# EAGLE schematic ESCD (EAGLE 9.6.2)
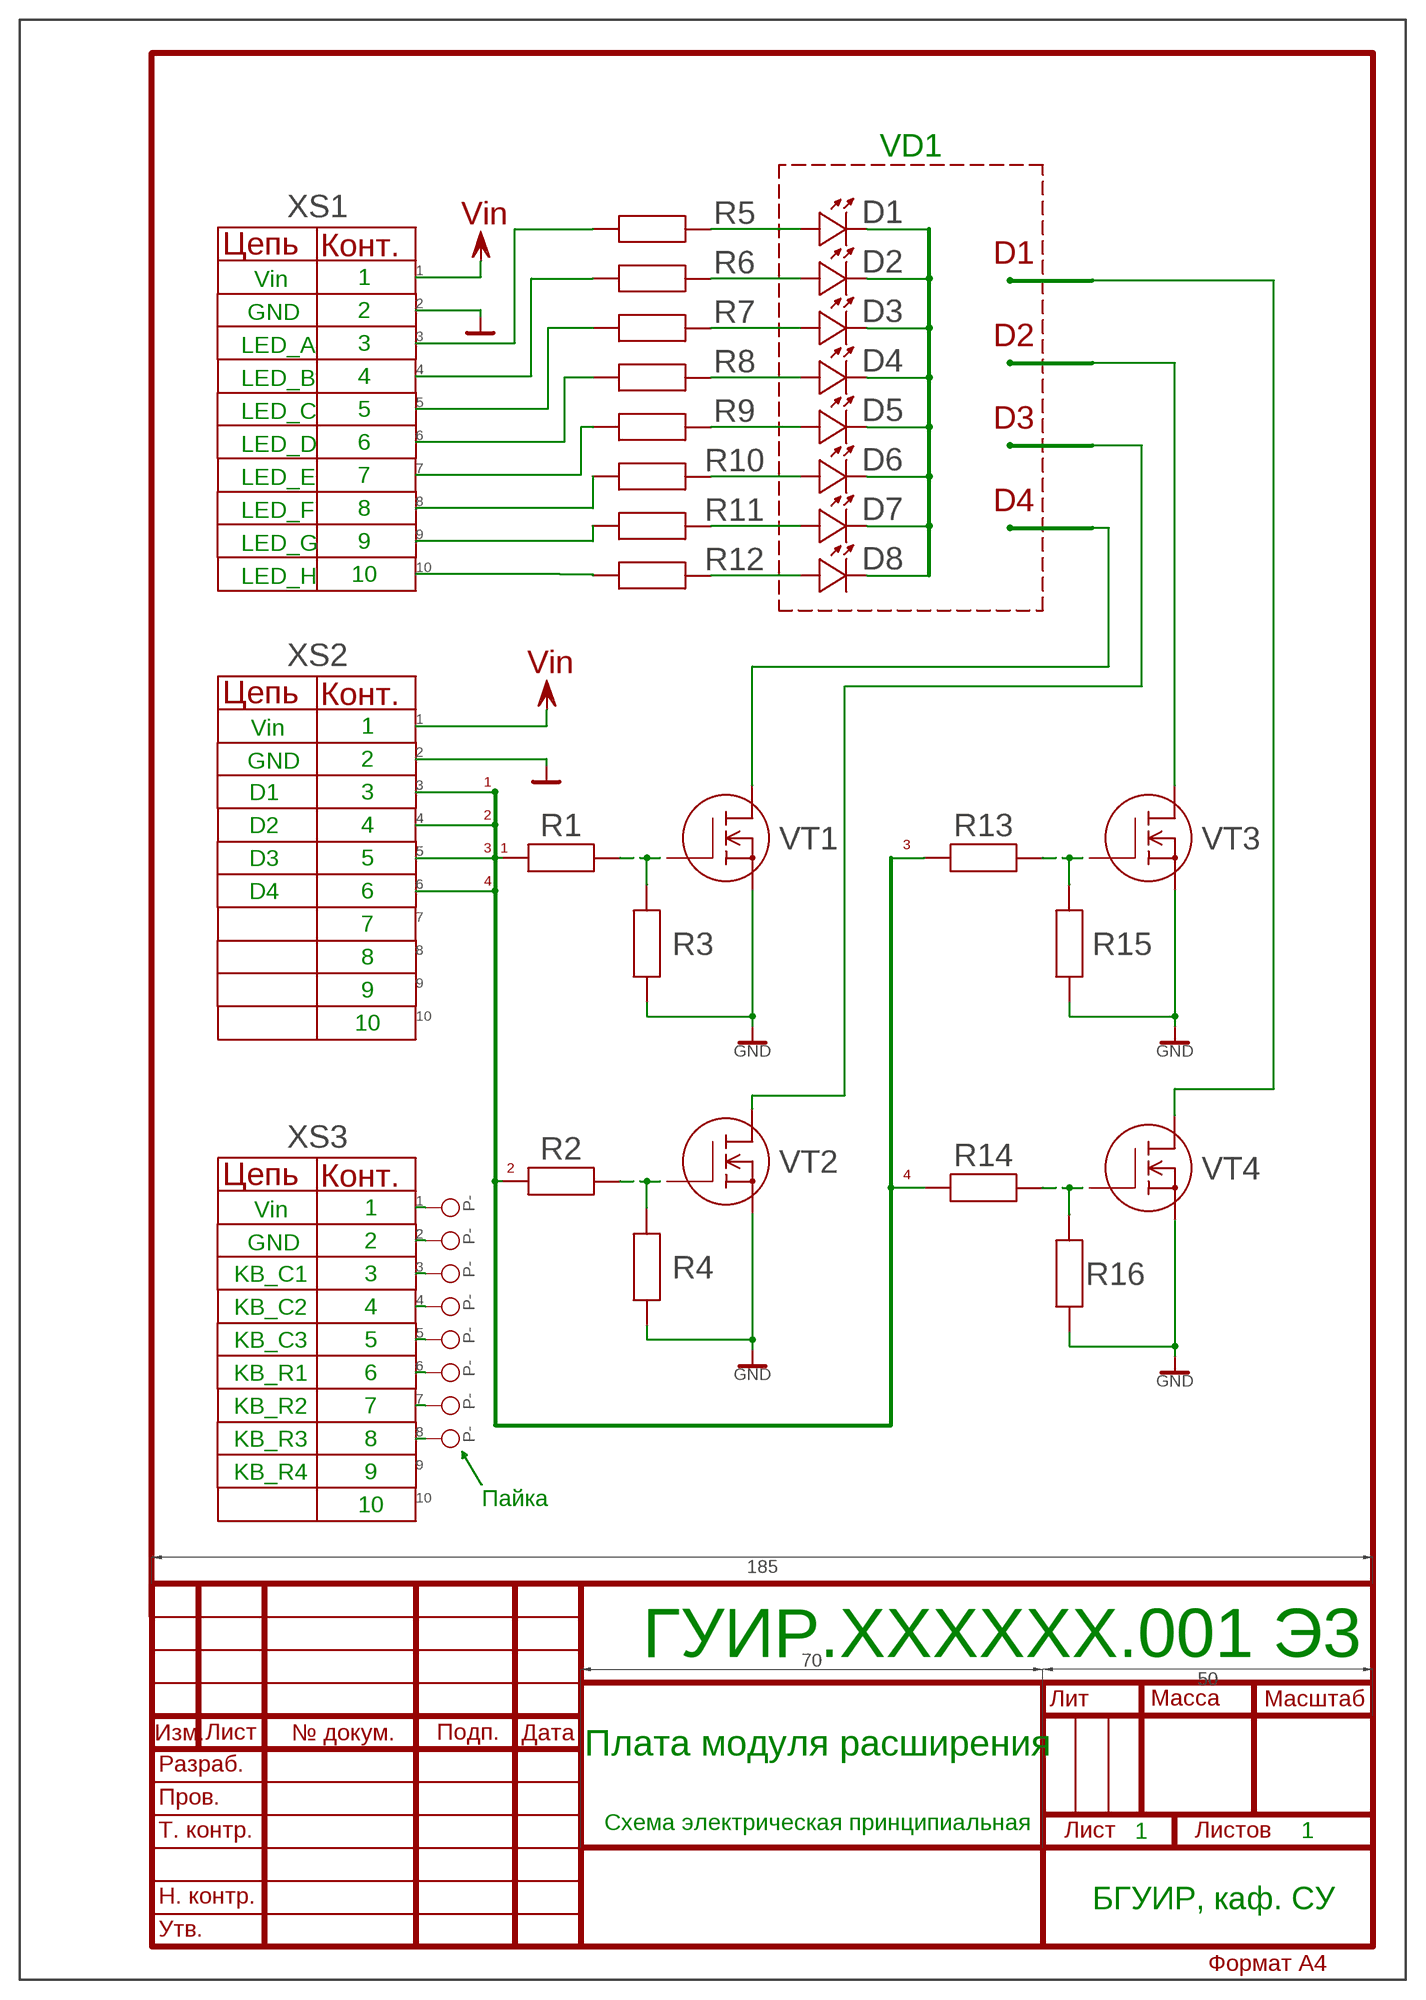
[diagram p0: schematic, sheet 1]

## Parts
D1  ESCD_LED  [SOD106A]
D2  ESCD_LED  [SOD106A]
D3  ESCD_LED  [SOD106A]
D4  ESCD_LED  [SOD106A]
D5  ESCD_LED  [SOD106A]
D6  ESCD_LED  [SOD106A]
D7  ESCD_LED  [SOD106A]
D8  ESCD_LED  [SOD106A]
R1  ESCD_RES  [R1206]
R2  ESCD_RES  [R1206]
R3  ESCD_RES  [R1206]
R4  ESCD_RES  [R1206]
R5  ESCD_RES  [R1206]
R6  ESCD_RES  [R1206]
R7  ESCD_RES  [R1206]
R8  ESCD_RES  [R1206]
R9  ESCD_RES  [R1206]
R10  ESCD_RES  [R1206]
R11  ESCD_RES  [R1206]
R12  ESCD_RES  [R1206]
R13  ESCD_RES  [R1206]
R14  ESCD_RES  [R1206]
R15  ESCD_RES  [R1206]
R16  ESCD_RES  [R1206]
VT1  MOSFET_GOST  [MOSFET]
VT2  MOSFET_GOST  [MOSFET]
VT3  MOSFET_GOST  [MOSFET]
VT4  MOSFET_GOST  [MOSFET]
XS1  ESCD_CONNECTOR_10POS  [S10B-PH-SM4-TB]
XS2  ESCD_CONNECTOR_10POS  [S10B-PH-SM4-TB]
XS3  ESCD_CONNECTOR_10POS  [S10B-PH-SM4-TB]

## Nets
GND: R3.1 R4.1 R15.1 R16.1 VT1.P$1 VT2.P$1 VT3.P$1 VT4.P$1 XS1.2 XS2.2
N$1: R5.2 XS1.3
N$2: R6.2 XS1.4
N$3: R7.2 XS1.5
N$4: R8.2 XS1.6
N$5: R9.2 XS1.7
N$6: R10.2 XS1.8
N$7: R11.2 XS1.9
N$8: XS1.10
N$9: VT4.P$2
N$11: VT2.P$2
N$12: VT1.P$2
N$13: R1.2 R3.2 VT1.P$3
N$14: R1.1 R2.1 R13.1 R14.1 XS2.3 XS2.4 XS2.5 XS2.6
N$15: R13.2 R15.2 VT3.P$3
N$16: R2.2 R4.2 VT2.P$3
N$17: R14.2 R16.2 VT4.P$3
N$20: VT3.P$2
N$21: R12.2
N$76: D1.A R5.1
N$77: D2.A R6.1
N$78: D3.A R7.1
N$79: D4.A R8.1
N$80: D5.A R9.1
N$81: D6.A R10.1
N$82: D7.A R11.1
N$83: D8.A R12.1
VCC: XS1.1 XS2.1 XS3.1 XS3.2 XS3.3 XS3.4 XS3.5 XS3.6 XS3.7 XS3.8 ; supply symbol labelled P-
Unconnected: D1.K D2.K D3.K D4.K D5.K D6.K D7.K D8.K XS2.7 XS2.8 XS2.9 XS2.10 XS3.9 XS3.10

## Notes on the sheet
- VD1
- Vin
- D1
- Vin | 1
- GND | 2
- LED_A | 3 | D2
- LED_B | 4
- LED_C | 5
- D3
- LED_D | 6
- LED_E | 7
- LED_F | 8 | D4
- LED_G | 9
- LED_H | 10
- Vin
- Vin | 1
- GND | 2
- 1
- D1
- 3
- 2
- D2
- 4
- 3 | 1 | 3
- D3
- 5
- 4
- D4
- 6
- 7
- 8
- 9
- 10
- 2
- 4
- Vin | 1
- GND | 2
- KB_C1
- 3
- KB_C2
- 4
- KB_C3
- 5
- KB_R1
- 6
- KB_R2
- 7
- KB_R3
- 8
- KB_R4
- 9
- Пайка
- 10
- ГУИР.ХХХХХХ.001 Э3
- Плата модуля расширения
- Схема электрическая принципиальная
- 1 | 1
- БГУИР, каф. СУ

## Library data of the parts
D1-D8 = ESCD:ESCD_LED: DIODE; MPN: BYS10/45; OC_FARNELL: 9549188; OC_NEWARK: 96K7236
R1-R16 = ESCD:ESCD_RES
VT1-VT4 = ESCD:MOSFET_GOST
XS1-XS3 = ESCD:ESCD_CONNECTOR_10POS: Wire to board connector Model suitable for S4B-PH-K Updated: 21.10.19 by Andrey Dovnar, andrevdovnar@gmail.com